# Altium schematic sheet Prototype_PCB.SchDoc
size A4
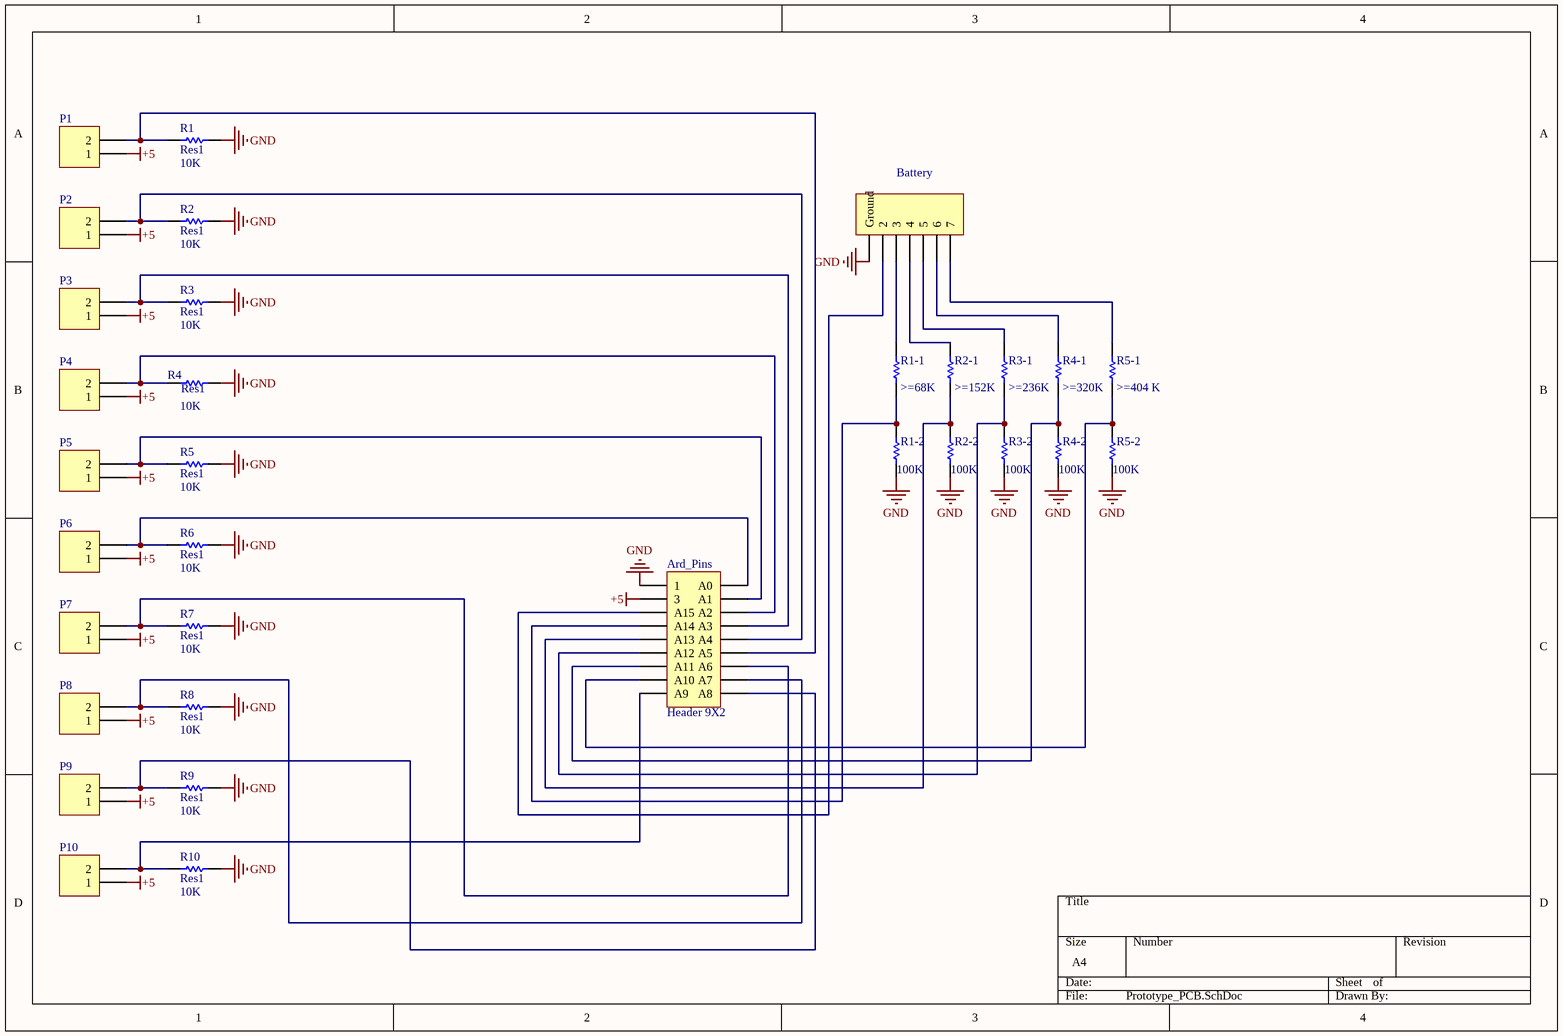
[diagram p0: Prototype_PCB.SchDoc]

## Parts
Ard_Pins  Header 9X2  [HDR2X9]
Battery  1  [HDR1X7]  (value not drawn)
P1  MHDR1X2  [MHDR1X2]  (value not drawn)
P2  MHDR1X2  [MHDR1X2]  (value not drawn)
P3  MHDR1X2  [MHDR1X2]  (value not drawn)
P4  MHDR1X2  [MHDR1X2]  (value not drawn)
P5  MHDR1X2  [MHDR1X2]  (value not drawn)
P6  MHDR1X2  [MHDR1X2]  (value not drawn)
P7  MHDR1X2  [MHDR1X2]  (value not drawn)
P8  MHDR1X2  [MHDR1X2]  (value not drawn)
P9  MHDR1X2  [MHDR1X2]  (value not drawn)
P10  MHDR1X2  [MHDR1X2]  (value not drawn)
R1  Res1  value 10K  [AXIAL-0.3]
R1-1  value >=68K  [AXIAL-0.3]  (hidden comment: Res1)
R1-2  value 100K  [AXIAL-0.3]  (hidden comment: Res1)
R2  Res1  value 10K  [AXIAL-0.3]
R2-1  value >=152K  [AXIAL-0.3]  (hidden comment: Res1)
R2-2  value 100K  [AXIAL-0.3]  (hidden comment: Res1)
R3  Res1  value 10K  [AXIAL-0.3]
R3-1  value >=236K  [AXIAL-0.3]  (hidden comment: Res1)
R3-2  value 100K  [AXIAL-0.3]  (hidden comment: Res1)
R4  Res1  value 10K  [AXIAL-0.3]
R4-1  value >=320K  [AXIAL-0.3]  (hidden comment: Res1)
R4-2  value 100K  [AXIAL-0.3]  (hidden comment: Res1)
R5  Res1  value 10K  [AXIAL-0.3]
R5-1  value >=404 K  [AXIAL-0.3]  (hidden comment: Res1)
R5-2  value 100K  [AXIAL-0.3]  (hidden comment: Res1)
R6  Res1  value 10K  [AXIAL-0.3]
R7  Res1  value 10K  [AXIAL-0.3]
R8  Res1  value 10K  [AXIAL-0.3]
R9  Res1  value 10K  [AXIAL-0.3]
R10  Res1  value 10K  [AXIAL-0.3]

## Nets
+5: Ard_Pins.3 P1.1 P2.1 P3.1 P4.1 P5.1 P6.1 P7.1 P8.1 P9.1 P10.1
GND: Ard_Pins.1 Battery.1(Ground) R1.2 R1-2.1 R2.2 R2-2.1 R3.2 R3-2.1 R4.2 R4-2.1 R5.2 R5-2.1 R6.2 R7.2 R8.2 R9.2 R10.2
NetArd_Pins_2: Ard_Pins.2(A0) P6.2 R6.1
NetArd_Pins_4: Ard_Pins.4(A1) P5.2 R5.1
NetArd_Pins_5: Ard_Pins.5(A15) Battery.2
NetArd_Pins_6: Ard_Pins.6(A2) P4.2 R4.1
NetArd_Pins_7: Ard_Pins.7(A14) R1-1.1 R1-2.2
NetArd_Pins_8: Ard_Pins.8(A3) P3.2 R3.1
NetArd_Pins_9: Ard_Pins.9(A13) R2-1.1 R2-2.2
NetArd_Pins_10: Ard_Pins.10(A4) P2.2 R2.1
NetArd_Pins_11: Ard_Pins.11(A12) R3-1.1 R3-2.2
NetArd_Pins_12: Ard_Pins.12(A5) P1.2 R1.1
NetArd_Pins_13: Ard_Pins.13(A11) R4-1.1 R4-2.2
NetArd_Pins_14: Ard_Pins.14(A6) P7.2 R7.1
NetArd_Pins_15: Ard_Pins.15(A10) R5-1.1 R5-2.2
NetArd_Pins_16: Ard_Pins.16(A7) P8.2 R8.1
NetArd_Pins_17: Ard_Pins.17(A9) P10.2 R10.1
NetArd_Pins_18: Ard_Pins.18(A8) P9.2 R9.1
NetBattery_3: Battery.3 R1-1.2
NetBattery_4: Battery.4 R2-1.2
NetBattery_5: Battery.5 R3-1.2
NetBattery_6: Battery.6 R4-1.2
NetBattery_7: Battery.7 R5-1.2

## Library data of the parts
Ard_Pins = Header 9X2: Header, 9-Pin, Dual row; LatestRevisionDate: 17-Jul-2002; LatestRevisionNote: Re-released for DXP Platform.; Publisher: Altium Limited
Battery = Header 7: Header, 7-Pin; LatestRevisionDate: 17-Jul-2002; LatestRevisionNote: Re-released for DXP Platform.; Publisher: Altium Limited
P1-P10 = MHDR1X2: Header, 2-Pin; LatestRevisionDate: 17-Jul-2002; LatestRevisionNote: Re-released for DXP Platform.; Publisher: Altium Limited
R1 R1-1 R1-2 R2 R2-1 R2-2 R3 R3-1 R3-2 R4 R4-1 R4-2 R5 R5-1 R5-2 R6-R10 = Res1: Resistor; Published: 8-Jun-2000; LatestRevisionDate: 17-Jul-2002; LatestRevisionNote: Re-released for DXP Platform.; PackageReference: AXIAL-0.3; Publisher: Altium Limited; PackageDescription: Axial Device, Thru-Hole; 2 Leads; 0.3 in Pin Spacing